# Altium project 3 Channel Buck Converter.PrjPcb
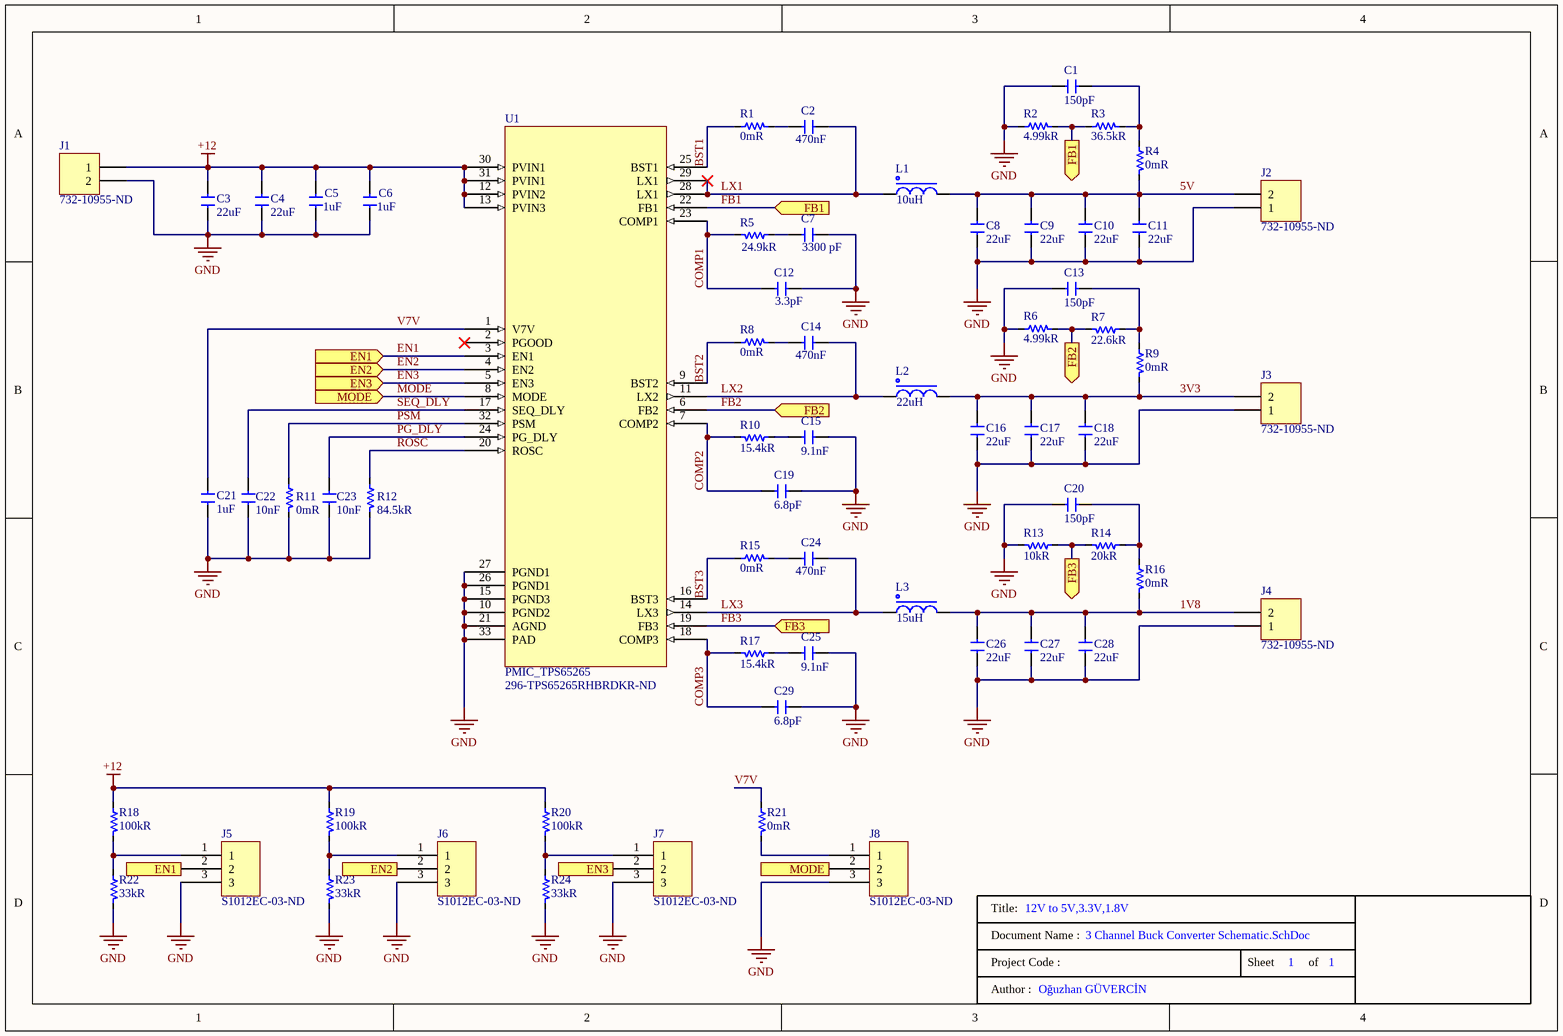
[diagram p0: 3 Channel Buck Converter Schematic.SchDoc]
1 sheet, 65 parts. Net scope: flat (ports and power ports of the same name join across sheets).
Board file: 3 Channel Buck Converter PCB.PcbDoc

## Sheet 3 Channel Buck Converter Schematic.SchDoc: 12V to 5V,3.3V,1.8V
size A4; Author: Oğuzhan GÜVERCİN; SheetNumber: 1; SheetTotal: 1

### Parts
C1  Capacitance: 150pF  [0603_CAP]  (hidden comment: CAP_150pF_%1_0603_50V_NP0_CER)
C2  Capacitance: 470nF  [0603_CAP]  (hidden comment: CAP_0.47uF_%10_0603_25V_X7R_CER)
C3  Capacitance: 22uF  [1206_CAP]  (hidden comment: CAP_22uF_%10_1206_25V_X5R_CER)
C4  Capacitance: 22uF  [1206_CAP]  (hidden comment: CAP_22uF_%10_1206_25V_X5R_CER)
C5  Capacitance: 1uF  [0603_CAP]  (hidden comment: CAP_1uF_%10_0603_25V_X7R_CER)
C6  Capacitance: 1uF  [0603_CAP]  (hidden comment: CAP_1uF_%10_0603_25V_X7R_CER)
C7  Capacitance: 3300 pF  [0603_CAP]  (hidden comment: CAP_3300pF_0603_50V_X7R_CER)
C8  Capacitance: 22uF  [1206_CAP]  (hidden comment: CAP_22uF_%10_1206_25V_X5R_CER)
C9  Capacitance: 22uF  [1206_CAP]  (hidden comment: CAP_22uF_%10_1206_25V_X5R_CER)
C10  Capacitance: 22uF  [1206_CAP]  (hidden comment: CAP_22uF_%10_1206_25V_X5R_CER)
C11  Capacitance: 22uF  [1206_CAP]  (hidden comment: CAP_22uF_%10_1206_25V_X5R_CER)
C12  Capacitance: 3.3pF  [0603_CAP]  (hidden comment: CAP_3.3pF_±0.1pF_0603_50V_NP0_CER)
C13  Capacitance: 150pF  [0603_CAP]  (hidden comment: CAP_150pF_%1_0603_50V_NP0_CER)
C14  Capacitance: 470nF  [0603_CAP]  (hidden comment: CAP_0.47uF_%10_0603_25V_X7R_CER)
C15  Capacitance: 9.1nF  [0603_CAP]  (hidden comment: CAP_9100pF_%5_0603_50V_U2J_CER)
C16  Capacitance: 22uF  [1206_CAP]  (hidden comment: CAP_22uF_%10_1206_25V_X5R_CER)
C17  Capacitance: 22uF  [1206_CAP]  (hidden comment: CAP_22uF_%10_1206_25V_X5R_CER)
C18  Capacitance: 22uF  [1206_CAP]  (hidden comment: CAP_22uF_%10_1206_25V_X5R_CER)
C19  Capacitance: 6.8pF  [0603_CAP]  (hidden comment: CAP_6.8pF_±0.5p_0603_50V_C0G/NP0_CER)
C20  Capacitance: 150pF  [0603_CAP]  (hidden comment: CAP_150pF_%1_0603_50V_NP0_CER)
C21  Capacitance: 1uF  [0603_CAP]  (hidden comment: CAP_1uF_%10_0603_25V_X7R_CER)
C22  Capacitance: 10nF  [0603_CAP]  (hidden comment: CAP_10nF_%20_0603_50V_X7R_CER)
C23  Capacitance: 10nF  [0603_CAP]  (hidden comment: CAP_10nF_%20_0603_50V_X7R_CER)
C24  Capacitance: 470nF  [0603_CAP]  (hidden comment: CAP_0.47uF_%10_0603_25V_X7R_CER)
C25  Capacitance: 9.1nF  [0603_CAP]  (hidden comment: CAP_9100pF_%5_0603_50V_U2J_CER)
C26  Capacitance: 22uF  [1206_CAP]  (hidden comment: CAP_22uF_%10_1206_25V_X5R_CER)
C27  Capacitance: 22uF  [1206_CAP]  (hidden comment: CAP_22uF_%10_1206_25V_X5R_CER)
C28  Capacitance: 22uF  [1206_CAP]  (hidden comment: CAP_22uF_%10_1206_25V_X5R_CER)
C29  Capacitance: 6.8pF  [0603_CAP]  (hidden comment: CAP_6.8pF_±0.5p_0603_50V_C0G/NP0_CER)
J1  Supplier Part Number 1: 732-10955-ND  [1x2_TERMINAL BLOCK]  (hidden comment: CON_1X2_Terminal Block)
J2  Supplier Part Number 1: 732-10955-ND  [1x2_TERMINAL BLOCK]  (hidden comment: CON_1X2_Terminal Block)
J3  Supplier Part Number 1: 732-10955-ND  [1x2_TERMINAL BLOCK]  (hidden comment: CON_1X2_Terminal Block)
J4  Supplier Part Number 1: 732-10955-ND  [1x2_TERMINAL BLOCK]  (hidden comment: CON_1X2_Terminal Block)
J5  Supplier Part Number 1: S1012EC-03-ND  [DIP_1X3_HEADER_2.54_PITCH]  (hidden comment: CON_1X3_2.54mm_Male Header)
J6  Supplier Part Number 1: S1012EC-03-ND  [DIP_1X3_HEADER_2.54_PITCH]  (hidden comment: CON_1X3_2.54mm_Male Header)
J7  Supplier Part Number 1: S1012EC-03-ND  [DIP_1X3_HEADER_2.54_PITCH]  (hidden comment: CON_1X3_2.54mm_Male Header)
J8  Supplier Part Number 1: S1012EC-03-ND  [DIP_1X3_HEADER_2.54_PITCH]  (hidden comment: CON_1X3_2.54mm_Male Header)
L1  Inductance: 10uH  [INDP120120X100N]  (hidden comment: IND_10uH_5A_26.5 mOHM_SMD)
L2  Inductance: 22uH  [INDP120120X100N]  (hidden comment: IND_22uH_3.2A_40 mOHM_SMD)
L3  Inductance: 15uH  [INDP120120X100N]  (hidden comment: IND_15uH_4.6A_36 mOHM_SMD)
R1  Resistance: 0mR  [0603_RES]  (hidden comment: RES_0 OHM_JUMPER_0603_1/10W)
R2  Resistance: 4.99kR  [0603_RES]  (hidden comment: RES_4.99K OHM_1%_0603_1/10W)
R3  Resistance: 36.5kR  [0603_RES]  (hidden comment: RES_36.5K OHM_1%_0603_1/10W)
R4  Resistance: 0mR  [0603_RES]  (hidden comment: RES_0 OHM_JUMPER_0603_1/10W)
R5  Resistance: 24.9kR  [0603_RES]  (hidden comment: RES_24.9K OHM_1%_0603_1/10W)
R6  Resistance: 4.99kR  [0603_RES]  (hidden comment: RES_4.99K OHM_1%_0603_1/10W)
R7  Resistance: 22.6kR  [0603_RES]  (hidden comment: RES_22.6K OHM_1%_0603_1/10W)
R8  Resistance: 0mR  [0603_RES]  (hidden comment: RES_0 OHM_JUMPER_0603_1/10W)
R9  Resistance: 0mR  [0603_RES]  (hidden comment: RES_0 OHM_JUMPER_0603_1/10W)
R10  Resistance: 15.4kR  [0603_RES]  (hidden comment: RES_15.4K OHM_1%_0603_1/10W)
R11  Resistance: 0mR  [0603_RES]  (hidden comment: RES_0 OHM_JUMPER_0603_1/10W)
R12  Resistance: 84.5kR  [0603_RES]  (hidden comment: RES_84.5K OHM_1%_0603_1/10W)
R13  Resistance: 10kR  [0603_RES]  (hidden comment: RES_10K OHM_1%_0603_1/10W)
R14  Resistance: 20kR  [0603_RES]  (hidden comment: RES_20K OHM _1%_0603_1/10W)
R15  Resistance: 0mR  [0603_RES]  (hidden comment: RES_0 OHM_JUMPER_0603_1/10W)
R16  Resistance: 0mR  [0603_RES]  (hidden comment: RES_0 OHM_JUMPER_0603_1/10W)
R17  Resistance: 15.4kR  [0603_RES]  (hidden comment: RES_15.4K OHM_1%_0603_1/10W)
R18  Resistance: 100kR  [0603_RES]  (hidden comment: RES_100K OHM_5%_0603_1/10W)
R19  Resistance: 100kR  [0603_RES]  (hidden comment: RES_100K OHM_5%_0603_1/10W)
R20  Resistance: 100kR  [0603_RES]  (hidden comment: RES_100K OHM_5%_0603_1/10W)
R21  Resistance: 0mR  [0603_RES]  (hidden comment: RES_0 OHM_JUMPER_0603_1/10W)
R22  Resistance: 33kR  [0603_RES]  (hidden comment: RES_33K OHM_5%_0603_1/10W)
R23  Resistance: 33kR  [0603_RES]  (hidden comment: RES_33K OHM_5%_0603_1/10W)
R24  Resistance: 33kR  [0603_RES]  (hidden comment: RES_33K OHM_5%_0603_1/10W)
U1  PMIC_TPS65265  Supplier Part Number 1: 296-TPS65265RHBRDKR-ND  [QFN50P500X500X100_HS-33N]

### Ports
EN1 (in), EN1 (out), EN2 (in), EN2 (out), EN3 (in), EN3 (out), FB1 (in), FB1 (out), FB2 (in), FB2 (out), FB3 (in), FB3 (out), MODE (in), MODE (out)

### Nets
+12: C3.2 C4.2 C5.2 C6.2 J1.1 R18.2 R19.2 R20.2 U1.12(PVIN2) U1.13(PVIN3) U1.30(PVIN1) U1.31(PVIN1)
GND: C1.1 C3.1 C4.1 C5.1 C6.1 C7.2 C8.1 C9.1 C10.1 C11.1 C12.2 C13.1 C15.2 C16.1 C17.1 C18.1 C19.2 C20.1 C21.2 C22.1 C23.1 C25.2 C26.1 C27.1 C28.1 C29.2 J1.2 J2.1 J3.1 J4.1 J5.3 J6.3 J7.3 J8.3 R2.1 R6.1 R11.1 R12.1 R13.1 R22.1 R23.1 R24.1 U1.10(PGND2) U1.15(PGND3) U1.21(AGND) U1.26(PGND1) U1.27(PGND1) U1.33(PAD)
1V8: C26.2 C27.2 C28.2 J4.2 L3.2 R16.2
3V3: C16.2 C17.2 C18.2 J3.2 L2.2 R9.2
5V: C8.2 C9.2 C10.2 C11.2 J2.2 L1.2 R4.2
BST1: R1.2 U1.25(BST1)
BST2: R8.2 U1.9(BST2)
BST3: R15.2 U1.16(BST3)
COMP1: C12.1 R5.1 U1.23(COMP1)
COMP2: C19.1 R10.1 U1.7(COMP2)
COMP3: C29.1 R17.1 U1.18(COMP3)
EN1: J5.2 U1.3(EN1) ; port EN1
EN2: J6.2 U1.4(EN2) ; port EN2
EN3: J7.2 U1.5(EN3) ; port EN3
FB1: R2.2 R3.1 U1.22(FB1) ; port FB1
FB2: R6.2 R7.1 U1.6(FB2) ; port FB2
FB3: R13.2 R14.1 U1.19(FB3) ; port FB3
LX1: C2.2 L1.1 U1.28(LX1) U1.29(LX1)
LX2: C14.2 L2.1 U1.11(LX2)
LX3: C24.2 L3.1 U1.14(LX3)
MODE: J8.2 U1.8(MODE) ; port MODE
PG_DLY: C23.2 U1.24(PG_DLY)
PSM: R11.2 U1.32(PSM)
ROSC: R12.2 U1.20(ROSC)
SEQ_DLY: C22.2 U1.17(SEQ_DLY)
V7V: C21.1 R21.2 U1.1(V7V)
NetC1_2: C1.2 R3.2 R4.1
NetC2_1: C2.1 R1.1
NetC7_1: C7.1 R5.2
NetC13_2: C13.2 R7.2 R9.1
NetC14_1: C14.1 R8.1
NetC15_1: C15.1 R10.2
NetC20_2: C20.2 R14.2 R16.1
NetC24_1: C24.1 R15.1
NetC25_1: C25.1 R17.2
NetJ5_1: J5.1 R18.1 R22.2
NetJ6_1: J6.1 R19.1 R23.2
NetJ7_1: J7.1 R20.1 R24.2
NetJ8_1: J8.1 R21.1

Not connected (* = marked no-connect by the designer): U1 2(PGOOD)*

### Notes on the sheet
- Title:
- Document Name :
- Project Code :
- Sheet
- of
- Author :

### Library data of the parts
C1 C13 C20 = CAP_150pF_%1_0603_50V_NP0_CER: 0603 150 pF 50 V ±1 % Tolerance C0G/NP0 SMT Multilayer Ceramic Capacitor; Manufacturer: Kyocera AVX; Manufacturer Part Number: 06035A151FAT2A; Tolerance: 1%; Dielectric: C0G; Voltage Rating: 50V; Temperature Coefficient: 0ppm/°C; Supplier 1: Digi-Key; RoHS: Yes; Category: Ceramic Capacitors; Stock 1: 18402; Pricing 1: 1=0,22000, 10=0,14900, 50=0,08920, 100=0,07530, 500=0,05154, 1000=0,04559 (USD); Mount: Surface Mount; Case/Package: 0603; Case Code (Metric): 1608; Case Code (Imperial): 0603; Contact Plating: Tin,Matte; Min Operating Temperature: -55°C; Max Operating Temperature: 125°C; Package Quantity: 8000; Packaging: Tape and Reel; Voltage Rating (DC): 50V; Termination: SMD/SMT; Length: 1.6mm; Width: 0.032inch; Depth: 0.81mm; Thickness: 0.035inch; Radiation Hardening: No; REACH SVHC: No SVHC; Lead Free: Lead Free; RoHS Compliant: Yes; ComponentLink1URL: https://datasheet.ciiva.com/11524/ccog-11524364.pdf?src-supplier=Avnet; ComponentLink1Description: https://datasheet.ciiva.com/11524/ccog-11524364.pdf?src-supplier=Avnet; ComponentLink2URL: https://datasheet.ciiva.com/16300/ccog-16300425.pdf?src-supplier=Future+Electronics; ComponentLink2Description: https://datasheet.ciiva.com/16300/ccog-16300425.pdf?src-supplier=Future+Electronics; ComponentLink3URL: https://datasheet.ciiva.com/209/ccog-209668.pdf?src-supplier=Digi-Key; ComponentLink3Description: https://datasheet.ciiva.com/209/ccog-209668.pdf?src-supplier=Digi-Key; ComponentLink4URL: https://datasheet.ciiva.com/22676/1796416-22676952.pdf?src-supplier=Element14; ComponentLink4Description: https://datasheet.ciiva.com/22676/1796416-22676952.pdf?src-supplier=Element14; ComponentLink5URL: https://datasheet.ciiva.com/28533/1796416-28533342.pdf?src-supplier=Element14; ComponentLink5Description: https://datasheet.ciiva.com/28533/1796416-28533342.pdf?src-supplier=Element14; ComponentLink6URL: https://datasheet.ciiva.com/5416/ccog-243403-5416088.pdf?src-supplier=Mouser; ComponentLink6Description: https://datasheet.ciiva.com/5416/ccog-243403-5416088.pdf?src-supplier=Mouser; Supplier Part Number 1: 478-10291-1-ND
C2 C14 C24 = CAP_0.47uF_%10_0603_25V_X7R_CER: 470nF Multilayer Ceramic Capacitor MLCC25 V; X7R Dielectric 0603 Surface Mount; Manufacturer: Wurth Electronics; Manufacturer Part Number: 885012206075; Voltage Rating: 25V; Tolerance: 10%; Supplier 1: Digi-Key; RoHS: Yes; Category: Ceramic Capacitors; Stock 1: 71771; Pricing 1: 1=0,10000, 10=0,09100, 100=0,08200, 500=0,07200 (USD); Mount: Surface Mount; Case/Package: 0603; Case Code (Metric): 1608; Case Code (Imperial): 0603; Min Operating Temperature: -55°C; Max Operating Temperature: 125°C; Packaging: Cut Tape; Dielectric: X7R; Voltage Rating (DC): 25V; Length: 0.063inch; Width: 0.031inch; Thickness: 0.037inch; REACH SVHC: Unknown; RoHS Compliant: Yes; ComponentLink1URL: http://www.farnell.com/datasheets/1958476.pdf?src-supplier=Farnell; ComponentLink1Description: http://www.farnell.com/datasheets/1958476.pdf?src-supplier=Farnell; ComponentLink2URL: https://katalog.we-online.de/pbs/datasheet/885012206075.pdf?src-supplier=Digi-Key; ComponentLink2Description: https://katalog.we-online.de/pbs/datasheet/885012206075.pdf?src-supplier=Digi-Key; ComponentLink3URL: http://www.farnell.com/datasheets/1958476.pdf?src-supplier=Newark; ComponentLink3Description: http://www.farnell.com/datasheets/1958476.pdf?src-supplier=Newark; ComponentLink4URL: http://www.farnell.com/datasheets/1958476.pdf?src-supplier=Element14; ComponentLink4Description: http://www.farnell.com/datasheets/1958476.pdf?src-supplier=Element14; Supplier Part Number 1: 732-7993-1-ND
C3 C4 C8-C11 C16-C18 C26-C28 = CAP_22uF_%10_1206_25V_X5R_CER: 1206 22 uF 25 V ±10% Tolerance X5R Multilayer Ceramic Chip Capacitor; Manufacturer: Yageo; Manufacturer Part Number: CC1206KKX5R8BB226; Voltage Rating: 25V; Supplier 1: Digi-Key; RoHS: Yes; Category: Ceramic Capacitors; Stock 1: 447; Pricing 1: 1=0,70000, 10=0,49700, 50=0,37600, 100=0,32740, 500=0,24256, 1000=0,20617 (USD); Mount: Surface Mount; Case/Package: 1206; Case Code (Imperial): 1206; Case Code (Metric): 3216; Weight: 0.000571oz; Min Operating Temperature: -55°C; Max Operating Temperature: 85°C; Dielectric: X5R; Packaging: Tape and Reel; Tolerance: 10%; Termination: SMD/SMT; Resistor Type: Ceramic; Voltage Rating (DC): 25V; Package Quantity: 2000; Length: 0.126inch; Width: 0.063inch; Thickness: 0.057inch; Lead Free: Lead Free; Halogen Free: Halogen Free; RoHS Compliant: Yes; ComponentLink1URL: http://www.mouser.com/ds/2/447/Yageo_UPY-GP_NP0_16V-to-50V_9-358835.pdf?src-supplier=Mouser; ComponentLink1Description: http://www.mouser.com/ds/2/447/Yageo_UPY-GP_NP0_16V-to-50V_9-358835.pdf?src-supplier=Mouser; ComponentLink2URL: http://www.yageo.com/documents/recent/UPY-GPHC_X5R_4V-to-50V_25.pdf?src-supplier=Digi-Key; ComponentLink2Description: http://www.yageo.com/documents/recent/UPY-GPHC_X5R_4V-to-50V_25.pdf?src-supplier=Digi-Key; ComponentLink3URL: http://www.yageo.com/documents/recent/UPY-GPHC_X5R_4V-to-50V_23.pdf?src-supplier=Digi-Key; ComponentLink3Description: http://www.yageo.com/documents/recent/UPY-GPHC_X5R_4V-to-50V_23.pdf?src-supplier=Digi-Key; Supplier Part Number 1: 311-3448-1-ND
C5 C6 C21 = CAP_1uF_%10_0603_25V_X7R_CER: TAPE DUCT CLOTH GRAY 3/4X 50YDS; Manufacturer: Yageo; Manufacturer Part Number: CC0603KPX7R8BB105; Supplier 1: Digi-Key; RoHS: Yes; Category: Ceramic Capacitors; Stock 1: 56889; Pricing 1: 1=0,26000, 10=0,17700, 50=0,11780, 100=0,10020, 500=0,07070, 1000=0,06186, 2500=0,05892, 5000=0,05450 (USD); Supplier Part Number 1: 13-CC0603KPX7R8BB105CT-ND; Supplier 2: Digi-Key; Stock 2: 56889; Pricing 2: 1=0,26000, 10=0,17700, 50=0,11780, 100=0,10020, 500=0,07070, 1000=0,06186, 2500=0,05892, 5000=0,05450 (USD); Supplier Part Number 2: 13-CC0603KPX7R8BB105DKR-ND
C7 = CAP_3300pF_0603_50V_X7R_CER: 3300 pF ±10% 50V Ceramic Capacitor X7R 0603 (1608 Metric); Manufacturer: Meritek; Manufacturer Part Number: MA0603XR332K500; Case/Package: 0603; Dielectric: X7R; Tolerance: ±10%; Termination: SMD/SMT; Resistor Type: Ceramic; Voltage Rating: 50V
C12 = CAP_3.3pF_±0.1pF_0603_50V_NP0_CER: 0603 3.3 pF 50 V ±0.1 pF Tolerance C0G/NP0 SMT Multilayer Ceramic Capacitor; Manufacturer: Kyocera AVX; Manufacturer Part Number: 06035A3R3BAT2A; Dielectric: C0G; Voltage Rating (DC): 50V; Dissipation Factor: 10%; Supplier 1: Digi-Key; RoHS: Yes; Category: Ceramic Capacitors; Mount: Surface Mount; Case/Package: 0603; Case Code (Imperial): 0603; Case Code (Metric): 1608; Min Operating Temperature: -55°C; Max Operating Temperature: 125°C; Packaging: Tape and Reel; Package Quantity: 1; Voltage Rating: 50V; Termination: SMD/SMT; Series: -; Construction: Flat; Length: 1.6mm; Width: 0.81mm; Height: 0.86mm; Depth: 0.81mm; Thickness: 0.035inch; Radiation Hardening: No; Lead Free: Lead Free; RoHS Compliant: Yes; ComponentLink1URL: https://datasheet.ciiva.com/7614/ccog-7614679.pdf?src-supplier=Digi-Key; ComponentLink1Description: https://datasheet.ciiva.com/7614/ccog-7614679.pdf?src-supplier=Digi-Key; ComponentLink2URL: https://datasheet.ciiva.com/14891/ccog-14891031.pdf?src-supplier=Digi-Key; ComponentLink2Description: https://datasheet.ciiva.com/14891/ccog-14891031.pdf?src-supplier=Digi-Key; ComponentLink3URL: https://datasheet.ciiva.com/14891/ccog-14891032.pdf?src-supplier=Digi-Key; ComponentLink3Description: https://datasheet.ciiva.com/14891/ccog-14891032.pdf?src-supplier=Digi-Key; ComponentLink4URL: https://datasheet.ciiva.com/17493/ccog-17493705.pdf?src-supplier=Avnet+Europe; ComponentLink4Description: https://datasheet.ciiva.com/17493/ccog-17493705.pdf?src-supplier=Avnet+Europe; ComponentLink5URL: https://datasheet.ciiva.com/214/ccog-214122.pdf?src-supplier=Digi-Key; ComponentLink5Description: https://datasheet.ciiva.com/214/ccog-214122.pdf?src-supplier=Digi-Key; ComponentLink6URL: https://datasheet.ciiva.com/11552/ccog-11552874.pdf?src-supplier=Avnet; ComponentLink6Description: https://datasheet.ciiva.com/11552/ccog-11552874.pdf?src-supplier=Avnet; Supplier Part Number 1: 478-7919-1-ND
C15 C25 = CAP_9100pF_%5_0603_50V_U2J_CER: Cap Ceramic 0.0091uF 50V U2J 5% Pad SMD 0603 Flexible Termination 125C T/R; Manufacturer: KEMET; Manufacturer Part Number: C0603X912J5JACTU; Supplier 1: Digi-Key; RoHS: Yes; Category: Ceramic Capacitors; Stock 1: 12624; Pricing 1: 1=0,47000, 10=0,33500, 50=0,25300, 100=0,22040, 500=0,16324, 1000=0,13875 (USD); Mount: Surface Mount; Case/Package: 0603; Case Code (Metric): 1608; Case Code (Imperial): 0603; Min Operating Temperature: -55°C; Max Operating Temperature: 125°C; Packaging: Tape and Reel; Voltage Rating: 50V; Tolerance: 5%; Features: Soft Termination; Length: 0.063inch; Width: 0.031inch; Thickness: 0.034inch; RoHS Compliant: Yes; ComponentLink1URL: http://www.farnell.com/datasheets/2157976.pdf?src-supplier=Element14; ComponentLink1Description: http://www.farnell.com/datasheets/2157976.pdf?src-supplier=Element14; ComponentLink2URL: http://www.kemet.com/docfinder?Partnumber=C0603X912J5JAC7867&src-supplier=Digi-Key; ComponentLink2Description: http://www.kemet.com/docfinder?Partnumber=C0603X912J5JAC7867&src-supplier=Digi-Key; ComponentLink3URL: https://api.kemet.com/component-edge/download/datasheet/C0603X912J5JAC7867.pdf?src-supplier=Digi-Key; ComponentLink3Description: https://api.kemet.com/component-edge/download/datasheet/C0603X912J5JAC7867.pdf?src-supplier=Digi-Key; Supplier Part Number 1: 399-13417-1-ND
C19 C29 = CAP_6.8pF_±0.5p_0603_50V_C0G/NP0_CER: 0603 6.8 pF 50 V ±0.5 pF Tolerance C0G/NP0 SMT Multilayer Ceramic Capacitor; Manufacturer: Kyocera AVX; Manufacturer Part Number: 06035A6R8DAT2A; Dielectric: C0G; Voltage Rating: 50V; Supplier 1: Digi-Key; RoHS: Yes; Category: Ceramic Capacitors; Stock 1: 84698; Pricing 1: 1=0,10000, 10=0,05600, 50=0,03040, 100=0,02480, 500=0,01772, 1000=0,01392 (USD); Mount: Surface Mount; Case/Package: 0603; Case Code (Imperial): 0603; Case Code (Metric): 1608; Min Operating Temperature: -55°C; Max Operating Temperature: 125°C; Packaging: Tape and Reel; Package Quantity: 4000; Voltage Rating (DC): 50V; Termination: SMD/SMT; Length: 1.6mm; Width: 0.81mm; Depth: 0.81mm; Thickness: 0.035inch; Radiation Hardening: No; Lead Free: Lead Free; RoHS Compliant: Yes; ComponentLink1URL: https://datasheet.ciiva.com/16327/ccog-16327085.pdf?src-supplier=Future+Electronics; ComponentLink1Description: https://datasheet.ciiva.com/16327/ccog-16327085.pdf?src-supplier=Future+Electronics; ComponentLink2URL: https://datasheet.ciiva.com/204/ccog-204489.pdf?src-supplier=Digi-Key; ComponentLink2Description: https://datasheet.ciiva.com/204/ccog-204489.pdf?src-supplier=Digi-Key; Supplier Part Number 1: 478-10335-1-ND
C22 C23 = CAP_10nF_%20_0603_50V_X7R_CER: Cap Ceramic 0.01uF 50V X7R 20% SMD 0603 125°C Paper T/R; Manufacturer: KEMET; Manufacturer Part Number: C0603C103M5RAC7411; Supplier 1: Digi-Key; RoHS: Yes; Category: Ceramic Capacitors; Stock 1: 173355; Pricing 1: 1=0,10000, 10=0,03000, 50=0,01640, 100=0,01350, 500=0,00962, 1000=0,00756, 2500=0,00688, 5000=0,00632 (USD); Mount: Surface Mount; Case/Package: 0603; Case Code (Imperial): 0603; Case Code (Metric): 1608; Contact Plating: Tin,Matte; Dielectric Material: Ceramic; Min Operating Temperature: -55°C; Max Operating Temperature: 125°C; Packaging: Tape and Reel; Package Quantity: 50000; Tolerance: 20%; Voltage Rating: 50V; Voltage Rating (DC): 50V; Dielectric: X7R; Termination: SMD/SMT; Series: C0603C; Construction: Flat; Length: 1.6mm; Height: 0.8mm; Lead Pitch: 0.7mm; Depth: 0.8mm; Radiation Hardening: No; RoHS Compliant: Yes; ComponentLink1URL: http://www.mouser.com/ds/2/212/KEM_C1002_X7R_SMD-1102033.pdf?src-supplier=Mouser; ComponentLink1Description: http://www.mouser.com/ds/2/212/KEM_C1002_X7R_SMD-1102033.pdf?src-supplier=Mouser; ComponentLink2URL: http://capacitoredge.kemet.com/capedge2/DataSheet?pn=C0603C103M5RAC7411&src-supplier=Avnet; ComponentLink2Description: http://capacitoredge.kemet.com/capedge2/DataSheet?pn=C0603C103M5RAC7411&src-supplier=Avnet; Supplier Part Number 1: 399-C0603C103M5RAC7411CT-ND
J1-J4 = CON_1X2_Terminal Block: Series 1377 - 5.00 mm Horizontal Entry with Pressure Clamp WR-TBL, 2 pin; Manufacturer: Wurth Electronics; Manufacturer Part Number: 691137710002; Plating: Copper Alloy; Number of Levels: 1; Number of Positions Per Level: 2; Current: 16A; Voltage: 300V; Wire Gauge (Max): 30AWG; Wire Gauge (Min): 12AWG; Supplier 1: Digi-Key; RoHS: No; Category: Terminal Blocks; Stock 1: 10587; Pricing 1: 1=0,39000, 10=0,35200, 50=0,31100, 100=0,27900, 500=0,26900 (USD); Mount: Through Hole; Color: Green; Housing Material: PC; Min Operating Temperature: -30°C; Max Operating Temperature: 120°C; Packaging: Bulk; Termination: Screw; ComponentLink1URL: https://katalog.we-online.de/em/datasheet/691137710002.pdf?src-supplier=Digi-Key; ComponentLink1Description: https://katalog.we-online.de/em/datasheet/691137710002.pdf?src-supplier=Digi-Key
J5-J8 = CON_1X3_2.54mm_Male Header: Conn Header Vert 3POS 2.54MM; Manufacturer: Sullins; Manufacturer Part Number: PREC003SAAN-RC; Number of Positions: 3; Connector Type: Male Pin; Pitch: 0.1inch; Supplier 1: Digi-Key; RoHS: Yes; Category: Connectors; Stock 1: 15048; Pricing 1: 1=0,09000, 10=0,08400, 25=0,06240, 50=0,05340, 100=0,05170, 250=0,04456, 500=0,04276 (USD); Mount: Through Hole; Color: Black; Contact Plating: Tin; Package Quantity: 1; Number of Rows: 1; Packaging: Bulk; Termination: Solder; Series: -; Contact Type: Male Pin; Contact Mating Length: 0.23inch; RoHS Compliant: Yes; ComponentLink1URL: https://datasheet.ciiva.com/740/zrzczzzszzn-rc-st-11635-b-740842.pdf?src-supplier=Digi-Key; ComponentLink1Description: https://datasheet.ciiva.com/740/zrzczzzszzn-rc-st-11635-b-740842.pdf?src-supplier=Digi-Key
L1 = IND_10uH_5A_26.5 mOHM_SMD: Fixed Ind 10UH 5A 26.5 Mohm SMD; Manufacturer: Wurth Electronics; Manufacturer Part Number: 784771100; Core Material: Ferrite; Saturation Current: 5.25A; Shielding: Shielded; DC Resistance (DCR): 26.5mR; Self Resonant Frequency: 22.3MHz; Test Frequency: 100kHz; Tolerance: 20%; Supplier 1: Mouser; RoHS: Yes; Category: Fixed Inductors; Stock 1: 177; Pricing 1: 1=2,37000, 10=2,11000, 50=1,96000, 100=1,89000, 1000=1,65000, 10000=1,65000 (USD); Mount: Surface Mount; Case/Package: Nonstandard; Min Operating Temperature: -40°C; Max Operating Temperature: 125°C; Packaging: Tape and Reel; Resistor Type: Wirewound; Current Rating: 5A; Length: 0.472inch; Width: 0.472inch; Height - Seated (Max): 0.248inch; Ratings: AEC-Q200; RoHS Compliant: No; ComponentLink1URL: https://media.digikey.com/pdf/Data%20Sheets/Wurth%20Electronics%20PDFs/Q+_Products_Flyer.pdf?src-supplier=Digi-Key; ComponentLink1Description: https://media.digikey.com/pdf/Data%20Sheets/Wurth%20Electronics%20PDFs/Q+_Products_Flyer.pdf?src-supplier=Digi-Key; Supplier Part Number 1: 710-784771100
L2 = IND_22uH_3.2A_40 mOHM_SMD: Fixed Ind 22UH 3.2A 40 Mohm SMD; Manufacturer: Wurth Electronics; Manufacturer Part Number: 784771220; Core Material: Ferrite; Saturation Current: 3.5A; Shielding: Shielded; DC Resistance (DCR): 40mR; Self Resonant Frequency: 14.9MHz; Test Frequency: 100kHz; Tolerance: 20%; Supplier 1: Digi-Key; RoHS: Yes; Category: Fixed Inductors; Stock 1: 156; Pricing 1: 1=2,37000, 10=2,10900, 50=1,95900, 100=1,88400, 250=1,80800 (USD); Mount: Surface Mount; Case/Package: Nonstandard; Min Operating Temperature: -40°C; Max Operating Temperature: 125°C; Packaging: Cut Tape; Resistor Type: Wirewound; Current Rating: 3.2A; Length: 0.472inch; Width: 0.472inch; Height - Seated (Max): 0.248inch; Ratings: AEC-Q200; RoHS Compliant: No; ComponentLink1URL: https://media.digikey.com/pdf/Data%20Sheets/Wurth%20Electronics%20PDFs/Q+_Products_Flyer.pdf?src-supplier=Digi-Key; ComponentLink1Description: https://media.digikey.com/pdf/Data%20Sheets/Wurth%20Electronics%20PDFs/Q+_Products_Flyer.pdf?src-supplier=Digi-Key; Supplier Part Number 1: 732-6773-1-ND
L3 = IND_15uH_4.6A_36 mOHM_SMD: Inductor, Aec-Q200, 15Uh, Shld, 4.6A Rohs Compliant: Yes; Manufacturer: Wurth Electronics; Manufacturer Part Number: 7847709150; Supplier 1: Digi-Key; RoHS: No; Category: Fixed Inductors; Stock 1: 908; Pricing 1: 1=2,82000, 10=2,78200, 50=2,59700, 100=2,41200 (USD); RoHS Compliant: No; Supplier Part Number 1: 732-11747-1-ND
R1 R4 R8 R9 R11 R15 R16 R21 = RES_0 OHM_JUMPER_0603_1/10W: CRCW Thick Film Commodity Chip Resistor Jumper 0603 Size 0 Ohm 0.1 W 2-Pin SMD Paper T/R; Manufacturer: Vishay; Manufacturer Part Number: CRCW06030000Z0EBC; Max Power Dissipation: 100mW; Supplier 1: Digi-Key; RoHS: Yes; Category: Chip SMD Resistors; Stock 1: 708702; Pricing 1: 10000=0,00332 (USD); Case/Package: 0603; Case Code (Imperial): 0603; Case Code (Metric): 1608; Min Operating Temperature: -55°C; Max Operating Temperature: 155°C; Resistor Type: Thick Film; Packaging: Cut Tape; Number of Terminations: 2; RoHS Compliant: Yes; ComponentLink1URL: http://www.vishay.com/docs/28773/crcwce3.pdf?src-supplier=Digi-Key; ComponentLink1Description: http://www.vishay.com/docs/28773/crcwce3.pdf?src-supplier=Digi-Key; Supplier Part Number 1: 541-4013-2-ND
R2 R6 = RES_4.99K OHM_1%_0603_1/10W: Res Thick Film 0603 4.99K Ohm 1% 1/10W ±100ppm/°C Molded SMD SMD Paper T/R; Manufacturer: Vishay Dale; Manufacturer Part Number: CRCW06034K99FKEB; Power Rating: 100mW; Voltage Rating: 75V; Supplier 1: Digi-Key; RoHS: Yes; Category: Chip SMD Resistors; Pricing 1: 1=0,10000, 10=0,03800, 100=0,01560, 1000=0,00701, 2500=0,00608, 5000=0,00503 (USD); Mount: Surface Mount; Case/Package: 0603; Weight: 7.1E-05oz; Case Code (Imperial): 0603; Case Code (Metric): 1608; Contact Plating: Tin; Size Code: 0603; Min Operating Temperature: -55°C; Max Operating Temperature: 155°C; Tolerance: 1%; Packaging: Tape and Reel; Package Quantity: 10000; Resistor Type: Thick Film; Number of Terminations: 2; Temperature Coefficient: 100ppm/°C; Max Power Dissipation: 100mW; Voltage Rating (DC): 75V; Features: Automotive AEC-Q200; Series: CRCW; Resistance Tolerance: 1%; Construction: Rectangular; Length: 1.55mm; Width: 0.85mm; Height: 0.02inch; Depth: 0.85mm; RoHS Compliant: Yes; REACH SVHC: Unknown; Military Standard: Not; Lead Free: Lead Free; ComponentLink1URL: https://datasheet.ciiva.com/5548/dcrcwe3-109170-5548185.pdf?src-supplier=Mouser; ComponentLink1Description: https://datasheet.ciiva.com/5548/dcrcwe3-109170-5548185.pdf?src-supplier=Mouser; ComponentLink2URL: https://datasheet.ciiva.com/9069/dcrcwe3-9069243.pdf?src-supplier=Avnet; ComponentLink2Description: https://datasheet.ciiva.com/9069/dcrcwe3-9069243.pdf?src-supplier=Avnet; Supplier Part Number 1: 541-CRCW06034K99FKEBCT-ND
R3 = RES_36.5K OHM_1%_0603_1/10W: Res Thick Film 0603 36.5K Ohm 1% 0.1W(1/10W) ±100ppm/C Molded SMD Automotive Paper T/R; Manufacturer: Vishay; Manufacturer Part Number: CRCW060336K5FKEA; Power Rating: 100mW; Voltage Rating: 75V; Temperature Coefficient: 100ppm/°C; RoHS: Yes; Category: Chip SMD Resistors; Pricing 1: 1=0,10000, 10=0,03800, 100=0,01560, 1000=0,00701, 2500=0,00608 (USD); Case/Package: 0603; Number of Pins: 2; Weight: 7.1E-05oz; Case Code (Imperial): 0603; Case Code (Metric): 1608; Contact Plating: Tin; Size Code: 0603; Min Operating Temperature: -55°C; Max Operating Temperature: 155°C; Tolerance: 1%; Packaging: Tape and Reel; Package Quantity: 5000; Resistor Type: Thick Film; Termination: SMD/SMT; Voltage Rating (DC): 75V; Features: Automotive AEC-Q200; Series: CRCW; Max Power Dissipation: 100mW; Number of Terminations: 2; Resistance Tolerance: 1%; Construction: Rectangular; Technology: THICK FILM; Length: 1.55mm; Width: 0.85mm; Height: 0.45mm; Depth: 0.85mm; Radiation Hardening: No; RoHS Compliant: Yes; REACH SVHC: Unknown; Military Standard: Not; Lead Free: Lead Free; ComponentLink1URL: https://datasheet.ciiva.com/11810/0900766b80d98afc-11810172.pdf?src-supplier=RSComponents; ComponentLink1Description: https://datasheet.ciiva.com/11810/0900766b80d98afc-11810172.pdf?src-supplier=RSComponents; ComponentLink2URL: https://datasheet.ciiva.com/5545/dcrcwe3-109170-5545862.pdf?src-supplier=Mouser; ComponentLink2Description: https://datasheet.ciiva.com/5545/dcrcwe3-109170-5545862.pdf?src-supplier=Mouser; ComponentLink3URL: https://datasheet.ciiva.com/3257/dcrcwe3-3257495.pdf?src-supplier=Avnet; ComponentLink3Description: https://datasheet.ciiva.com/3257/dcrcwe3-3257495.pdf?src-supplier=Avnet; ComponentLink4URL: https://datasheet.ciiva.com/3257/dcrcwe3-3257496.pdf?src-supplier=Avnet; ComponentLink4Description: https://datasheet.ciiva.com/3257/dcrcwe3-3257496.pdf?src-supplier=Avnet; ComponentLink5URL: https://datasheet.ciiva.com/16765/70201119-16765097.pdf?src-supplier=Allied+Electronics; ComponentLink5Description: https://datasheet.ciiva.com/16765/70201119-16765097.pdf?src-supplier=Allied+Electronics; ComponentLink6URL: https://datasheet.ciiva.com/16893/dcrcwe3-16893273.pdf?src-supplier=Avnet+Europe; ComponentLink6Description: https://datasheet.ciiva.com/16893/dcrcwe3-16893273.pdf?src-supplier=Avnet+Europe; ComponentLink7URL: https://datasheet.ciiva.com/22705/1697337-22705850.pdf?src-supplier=Element14; ComponentLink7Description: https://datasheet.ciiva.com/22705/1697337-22705850.pdf?src-supplier=Element14; ComponentLink8URL: https://datasheet.ciiva.com/7671/1697337-7671643.pdf?src-supplier=Element14; ComponentLink8Description: https://datasheet.ciiva.com/7671/1697337-7671643.pdf?src-supplier=Element14; ComponentLink9URL: https://datasheet.ciiva.com/7792/125364-7792235.pdf?src-supplier=Element14; ComponentLink9Description: https://datasheet.ciiva.com/7792/125364-7792235.pdf?src-supplier=Element14; ComponentLink10URL: https://datasheet.ciiva.com/7671/1697337-7671644.pdf?src-supplier=Element14; ComponentLink10Description: https://datasheet.ciiva.com/7671/1697337-7671644.pdf?src-supplier=Element14; ComponentLink11URL: https://datasheet.ciiva.com/16395/dcrcwe3-16395406.pdf?src-supplier=Future+Electronics; ComponentLink11Description: https://datasheet.ciiva.com/16395/dcrcwe3-16395406.pdf?src-supplier=Future+Electronics; Supplier Part Number 1: 541-36.5KHCT-ND; Supplier 1: Digi-Key
R5 = RES_24.9K OHM_1%_0603_1/10W: Res Thick Film 0603 24.9K Ohm 1% 1/10W ±100ppm/°C Molded SMD SMD Paper T/R; Manufacturer: Vishay Dale; Manufacturer Part Number: CRCW060324K9FKTA; Power Rating: 100mW; Voltage Rating: 75V; Supplier 1: Digi-Key; RoHS: No; Category: Chip SMD Resistors; Stock 1: 743; Pricing 1: 1=0,16000, 10=0,13900, 100=0,05350, 1000=0,02353, 2500=0,02032 (USD); Case/Package: 0603; Number of Pins: 2; Weight: 7.1E-05oz; Case Code (Imperial): 0603; Case Code (Metric): 1608; Contact Plating: Tin,Lead; Size Code: 0603; Min Operating Temperature: -55°C; Max Operating Temperature: 155°C; Tolerance: 1%; Resistor Type: Thick Film; Packaging: Tape and Reel; Package Quantity: 5000; Number of Terminations: 2; Temperature Coefficient: 100ppm/°C; Max Power Dissipation: 100mW; Power Dissipation: 100mW; Voltage Rating (DC): 75V; Features: Automotive AEC-Q200; Series: CRCW; Construction: Rectangular; Resistance Tolerance: 1%; Length: 1.55mm; Width: 0.85mm; Height: 0.02inch; Depth: 0.85mm; Radiation Hardening: No; RoHS Compliant: No; REACH SVHC: Unknown; Military Standard: Not; Lead Free: Contains Lead; ComponentLink1URL: https://datasheet.ciiva.com/16430/dcrcw-16430103.pdf?src-supplier=Future+Electronics; ComponentLink1Description: https://datasheet.ciiva.com/16430/dcrcw-16430103.pdf?src-supplier=Future+Electronics; ComponentLink2URL: https://datasheet.ciiva.com/2565/dcrcw-2565163.pdf?src-supplier=Digi-Key; ComponentLink2Description: https://datasheet.ciiva.com/2565/dcrcw-2565163.pdf?src-supplier=Digi-Key; ComponentLink3URL: https://datasheet.ciiva.com/9024/dcrcw-9024956.pdf?src-supplier=Avnet; ComponentLink3Description: https://datasheet.ciiva.com/9024/dcrcw-9024956.pdf?src-supplier=Avnet; Supplier Part Number 1: 541-CRCW060324K9FKTACT-ND
R7 = RES_22.6K OHM_1%_0603_1/10W: CRCW Thick Film Commodity Chip Resistor 0603 Size 22.6K Ohm 1% 0.1 W 100 ppm/K 2-Pin SMD Paper T/R; Manufacturer: Vishay; Manufacturer Part Number: CRCW060322K6FKEBC; Supplier 1: Digi-Key; RoHS: Yes; Category: Chip SMD Resistors; Pricing 1: 60000=0,00313, 100000=0,00307 (USD); RoHS Compliant: Yes; Supplier Part Number 1: CRCW060322K6FKEBC-ND
R10 R17 = RES_15.4K OHM_1%_0603_1/10W: Res SMD 15.4K Ohm 1% 1/10W 0603; Manufacturer: Vishay Dale; Manufacturer Part Number: CRCW060315K4FKEB; Power Rating: 100mW; Voltage Rating: 75V; Temperature Coefficient: 100ppm/°C; Supplier 1: Digi-Key; RoHS: Yes; Category: Chip SMD Resistors; Stock 1: 6; Pricing 1: 1=0,10000, 10=0,03800, 100=0,01560, 1000=0,00701, 2500=0,00608, 5000=0,00503 (USD); Case/Package: 0603; Weight: 7.1E-05oz; Case Code (Imperial): 0603; Case Code (Metric): 1608; Min Operating Temperature: -55°C; Max Operating Temperature: 155°C; Tolerance: 1%; Packaging: Tape and Reel; Package Quantity: 10000; Resistor Type: Thick Film; Number of Terminations: 2; Termination: SMD/SMT; Max Power Dissipation: 100mW; Features: Automotive AEC-Q200; Series: CRCW; Length: 0.061inch; Width: 0.033inch; Height: 0.02inch; RoHS Compliant: Yes; Lead Free: Lead Free; ComponentLink1URL: https://datasheet.ciiva.com/5544/dcrcwe3-109170-5544853.pdf?src-supplier=Mouser; ComponentLink1Description: https://datasheet.ciiva.com/5544/dcrcwe3-109170-5544853.pdf?src-supplier=Mouser; Supplier Part Number 1: 541-CRCW060315K4FKEBCT-ND
R12 = RES_84.5K OHM_1%_0603_1/10W: Res Thick Film 0603 84.5K Ohm 1% 1/10W ±100ppm/°C Molded SMD SMD Paper T/R; Manufacturer: Vishay; Manufacturer Part Number: CRCW060384K5FKEA; Power Rating: 100mW; Voltage Rating: 75V; Supplier 1: Digi-Key; RoHS: Yes; Category: Chip SMD Resistors; Stock 1: 4; Pricing 1: 1=0,10000, 10=0,03800, 100=0,01560, 1000=0,00701, 2500=0,00608 (USD); Case/Package: 0603; Number of Pins: 2; Weight: 7.1E-05oz; Case Code (Imperial): 0603; Case Code (Metric): 1608; Contact Plating: Tin; Min Operating Temperature: -55°C; Max Operating Temperature: 155°C; Tolerance: 1%; Packaging: Tape and Reel; Package Quantity: 10; Termination: SMD/SMT; Resistor Type: Thick Film; Number of Terminations: 2; Temperature Coefficient: 100ppm/°C; Max Power Dissipation: 100mW; Voltage Rating (DC): 75V; Features: Automotive AEC-Q200; Series: CRCW; Construction: Rectangular; Resistance Tolerance: 1%; Length: 1.55mm; Width: 0.85mm; Height: 0.02inch; Depth: 0.85mm; Radiation Hardening: No; REACH SVHC: Unknown; Military Standard: Not; Lead Free: Lead Free; RoHS Compliant: Yes; ComponentLink1URL: https://datasheet.ciiva.com/8986/dcrcwe3-8986391.pdf?src-supplier=Avnet; ComponentLink1Description: https://datasheet.ciiva.com/8986/dcrcwe3-8986391.pdf?src-supplier=Avnet; ComponentLink2URL: https://datasheet.ciiva.com/22871/70201119-22871818.pdf?src-supplier=Allied+Electronics; ComponentLink2Description: https://datasheet.ciiva.com/22871/70201119-22871818.pdf?src-supplier=Allied+Electronics; ComponentLink3URL: https://datasheet.ciiva.com/2513/dcrcwe3-2513644.pdf?src-supplier=Digi-Key; ComponentLink3Description: https://datasheet.ciiva.com/2513/dcrcwe3-2513644.pdf?src-supplier=Digi-Key; ComponentLink4URL: https://datasheet.ciiva.com/2513/dcrcwe3-2513645.pdf?src-supplier=Digi-Key; ComponentLink4Description: https://datasheet.ciiva.com/2513/dcrcwe3-2513645.pdf?src-supplier=Digi-Key; ComponentLink5URL: https://datasheet.ciiva.com/16204/dcrcw-16204237.pdf?src-supplier=Future+Electronics; ComponentLink5Description: https://datasheet.ciiva.com/16204/dcrcw-16204237.pdf?src-supplier=Future+Electronics; ComponentLink6URL: https://datasheet.ciiva.com/2513/dcrcwe3-2513646.pdf?src-supplier=Digi-Key; ComponentLink6Description: https://datasheet.ciiva.com/2513/dcrcwe3-2513646.pdf?src-supplier=Digi-Key; ComponentLink7URL: https://datasheet.ciiva.com/7816/1697337-7816078.pdf?src-supplier=Element14; ComponentLink7Description: https://datasheet.ciiva.com/7816/1697337-7816078.pdf?src-supplier=Element14; ComponentLink8URL: https://datasheet.ciiva.com/7816/1697337-7816079.pdf?src-supplier=Element14; ComponentLink8Description: https://datasheet.ciiva.com/7816/1697337-7816079.pdf?src-supplier=Element14; Supplier Part Number 1: 541-84.5KHCT-ND
R13 = RES_10K OHM_1%_0603_1/10W: Res Thick Film 0603 10K Ohm 1% 0.1W(1/10W) ±100ppm/C Pad SMD Automotive T/R; Manufacturer: Vishay Dale; Manufacturer Part Number: CRCW060310K0FKEE; Max Power Dissipation: 100mW; Temperature Coefficient: 100ppm/°C; Supplier 1: Digi-Key; RoHS: Yes; Category: Chip SMD Resistors; Pricing 1: 50000=0,00352 (USD); Case/Package: 0603; Min Operating Temperature: -55°C; Max Operating Temperature: 155°C; Package Quantity: 50000; Packaging: Tape and Reel; Resistor Type: Thick Film; Number of Terminations: 2; Tolerance: 1%; Features: Automotive AEC-Q200; Length: 0.061inch; Width: 0.033inch; Height: 0.02inch; Lead Free: Lead Free; RoHS Compliant: Yes; ComponentLink1URL: http://www.vishay.com/docs/20035/dcrcwe3.pdf?src-supplier=Digi-Key; ComponentLink1Description: http://www.vishay.com/docs/20035/dcrcwe3.pdf?src-supplier=Digi-Key; Supplier Part Number 1: CRCW060310K0FKEE-ND
R14 = RES_20K OHM _1%_0603_1/10W: Res Thick Film 0603 20K Ohm 1% 1/10W ±100ppm/°C Molded SMD SMD Paper T/R; Manufacturer: Vishay Dale; Manufacturer Part Number: CRCW060320K0FKEB; Power Rating: 100mW; Voltage Rating: 75V; Supplier 1: Digi-Key; RoHS: Yes; Category: Chip SMD Resistors; Pricing 1: 1=0,10000, 10=0,03800, 100=0,01560, 1000=0,00701, 2500=0,00608, 5000=0,00503 (USD); Case/Package: 0603; Number of Pins: 2; Weight: 7.1E-05oz; Case Code (Imperial): 0603; Case Code (Metric): 1608; Contact Plating: Tin; Min Operating Temperature: -55°C; Max Operating Temperature: 155°C; Tolerance: 1%; Packaging: Tape and Reel; Package Quantity: 10000; Resistor Type: Thick Film; Number of Terminations: 2; Temperature Coefficient: 100ppm/°C; Max Power Dissipation: 100mW; Voltage Rating (DC): 75V; Features: Automotive AEC-Q200; Series: CRCW; Resistance Tolerance: 1%; Construction: Rectangular; Length: 1.55mm; Width: 0.85mm; Height: 0.02inch; Depth: 0.85mm; Radiation Hardening: No; REACH SVHC: Unknown; Military Standard: Not; Lead Free: Lead Free; RoHS Compliant: Yes; ComponentLink1URL: http://components.arrow.com/part/dataview/41401338S39653N6892?src-supplier=Arrow+Electronics; ComponentLink1Description: http://components.arrow.com/part/dataview/41401338S39653N6892?src-supplier=Arrow+Electronics; ComponentLink2URL: http://www.mouser.com/ds/2/427/dcrcwe3-109170.pdf?src-supplier=Mouser; ComponentLink2Description: http://www.mouser.com/ds/2/427/dcrcwe3-109170.pdf?src-supplier=Mouser; ComponentLink3URL: http://www.farnell.com/datasheets/2111203.pdf?src-supplier=Farnell; ComponentLink3Description: http://www.farnell.com/datasheets/2111203.pdf?src-supplier=Farnell; ComponentLink4URL: http://components.arrow.com/part/dataview/0323_06078073?src-supplier=Arrow+Europe; ComponentLink4Description: http://components.arrow.com/part/dataview/0323_06078073?src-supplier=Arrow+Europe; ComponentLink5URL: http://www.farnell.com/datasheets/2111203.pdf?src-supplier=Newark; ComponentLink5Description: http://www.farnell.com/datasheets/2111203.pdf?src-supplier=Newark; ComponentLink6URL: http://www.vishay.com/docs/20035/dcrcwe3.pdf?src-supplier=Avnet; ComponentLink6Description: http://www.vishay.com/docs/20035/dcrcwe3.pdf?src-supplier=Avnet; ComponentLink7URL: http://www.farnell.com/datasheets/2111203.pdf?src-supplier=Element14; ComponentLink7Description: http://www.farnell.com/datasheets/2111203.pdf?src-supplier=Element14; ComponentLink8URL: http://www.vishay.com/docs/20035/dcrcwe3.pdf?src-supplier=Digi-Key; ComponentLink8Description: http://www.vishay.com/docs/20035/dcrcwe3.pdf?src-supplier=Digi-Key; Supplier Part Number 1: 541-CRCW060320K0FKEBDKR-ND
R18-R20 = RES_100K OHM_5%_0603_1/10W: Res Thick Film 0603 100K Ohm 5% 1/10W ±200ppm/°C Molded SMD SMD Paper T/R; Manufacturer: Vishay Dale; Manufacturer Part Number: CRCW0603100KJNEB; Power Rating: 100mW; Voltage Rating: 75V; RoHS: Yes; Category: Chip SMD Resistors; Stock 1: 592; Pricing 1: 1=0,10000, 10=0,03300, 100=0,01360, 1000=0,00610, 2500=0,00529, 5000=0,00437 (USD); Case/Package: 0603; Weight: 7.1E-05oz; Case Code (Imperial): 0603; Case Code (Metric): 1608; Contact Plating: Tin; Min Operating Temperature: -55°C; Max Operating Temperature: 155°C; Packaging: Tape and Reel; Tolerance: 5%; Package Quantity: 10000; Resistor Type: Thick Film; Number of Terminations: 2; Termination: SMD/SMT; Temperature Coefficient: 200ppm/°C; Max Power Dissipation: 100mW; Features: Automotive AEC-Q200; Series: CRCW; Construction: Rectangular; Length: 1.55mm; Width: 0.033inch; Height: 0.02inch; Depth: 0.85mm; Radiation Hardening: No; RoHS Compliant: Yes; Military Standard: Not; Lead Free: Lead Free; ComponentLink1URL: https://datasheet.ciiva.com/5543/dcrcwe3-109170-5543336.pdf?src-supplier=Mouser; ComponentLink1Description: https://datasheet.ciiva.com/5543/dcrcwe3-109170-5543336.pdf?src-supplier=Mouser; ComponentLink2URL: https://datasheet.ciiva.com/3256/dcrcwe3-3256922.pdf?src-supplier=Avnet; ComponentLink2Description: https://datasheet.ciiva.com/3256/dcrcwe3-3256922.pdf?src-supplier=Avnet; ComponentLink3URL: https://datasheet.ciiva.com/3256/dcrcwe3-3256923.pdf?src-supplier=Avnet; ComponentLink3Description: https://datasheet.ciiva.com/3256/dcrcwe3-3256923.pdf?src-supplier=Avnet; Supplier Part Number 1: 541-CRCW0603100KJNEBCT-ND; Supplier 1: Digi-Key
R22-R24 = RES_33K OHM_5%_0603_1/10W: Res Thick Film 0603 33K Ohm 5% 1/10W ±200ppm/°C Molded SMD SMD Paper T/R; Manufacturer: Vishay Dale; Manufacturer Part Number: CRCW060333K0JNEA; Power Rating: 100mW; Voltage Rating: 75V; Supplier 1: Digi-Key; RoHS: Yes; Category: Chip SMD Resistors; Stock 1: 6675; Pricing 1: 1=0,10000, 10=0,03300, 100=0,01360, 1000=0,00610, 2500=0,00529 (USD); Mount: Surface Mount; Case/Package: 0603; Number of Pins: 2; Case Code (Metric): 1608; Case Code (Imperial): 0603; Weight: 7.1E-05oz; Contact Plating: Tin; Size Code: 0603; Min Operating Temperature: -55°C; Max Operating Temperature: 155°C; Tolerance: 5%; Packaging: Tape and Reel; Resistor Type: Thick Film; Package Quantity: 1; Number of Terminations: 2; Termination: SMD/SMT; Temperature Coefficient: 200ppm/°C; Max Power Dissipation: 100mW; Voltage Rating (DC): 75V; Features: Automotive AEC-Q200; Series: CRCW; Construction: Rectangular; Resistance Tolerance: 5%; Technology: THICK FILM; Length: 1.55mm; Width: 0.033inch; Height: 0.45mm; Depth: 0.85mm; Radiation Hardening: No; Lead Free: Lead Free; RoHS Compliant: Yes; Military Standard: Not; REACH SVHC: Unknown; ComponentLink1URL: https://datasheet.ciiva.com/2462/dcrcwe3-2462529.pdf?src-supplier=Digi-Key; ComponentLink1Description: https://datasheet.ciiva.com/2462/dcrcwe3-2462529.pdf?src-supplier=Digi-Key; ComponentLink2URL: https://datasheet.ciiva.com/2462/dcrcwe3-2462530.pdf?src-supplier=Digi-Key; ComponentLink2Description: https://datasheet.ciiva.com/2462/dcrcwe3-2462530.pdf?src-supplier=Digi-Key; ComponentLink3URL: https://datasheet.ciiva.com/2462/dcrcwe3-2462531.pdf?src-supplier=Digi-Key; ComponentLink3Description: https://datasheet.ciiva.com/2462/dcrcwe3-2462531.pdf?src-supplier=Digi-Key; ComponentLink4URL: https://datasheet.ciiva.com/16778/70201119-16778952.pdf?src-supplier=Allied+Electronics; ComponentLink4Description: https://datasheet.ciiva.com/16778/70201119-16778952.pdf?src-supplier=Allied+Electronics; ComponentLink5URL: https://datasheet.ciiva.com/5551/dcrcwe3-109170-5551035.pdf?src-supplier=Mouser; ComponentLink5Description: https://datasheet.ciiva.com/5551/dcrcwe3-109170-5551035.pdf?src-supplier=Mouser; ComponentLink6URL: https://datasheet.ciiva.com/16389/dcrcwe3-16389979.pdf?src-supplier=Future+Electronics; ComponentLink6Description: https://datasheet.ciiva.com/16389/dcrcwe3-16389979.pdf?src-supplier=Future+Electronics; ComponentLink7URL: https://datasheet.ciiva.com/3257/dcrcwe3-3257469.pdf?src-supplier=Avnet; ComponentLink7Description: https://datasheet.ciiva.com/3257/dcrcwe3-3257469.pdf?src-supplier=Avnet; ComponentLink8URL: https://datasheet.ciiva.com/3257/dcrcwe3-3257470.pdf?src-supplier=Avnet; ComponentLink8Description: https://datasheet.ciiva.com/3257/dcrcwe3-3257470.pdf?src-supplier=Avnet; Supplier Part Number 1: 541-33KGCT-ND
U1 = PMIC_TPS65265: 4.5- to 17-V Input Voltage, 5-A/3-A/2-A Output Current Triple Buck Converter 32-VQFN -40 to 85; Manufacturer: Texas Instruments; Manufacturer Part Number: TPS65265RHBR; Output Type: Adjustable; Output Configuration: Positive; Number of Outputs: 3; Min Input Voltage: 4.5V; Max Input Voltage: 17V; Min Output Voltage: 600mV; Output Current: 2A; Switching Frequency: 2.3MHz; Synchronous Rectifier: Yes; Supplier 1: Digi-Key; RoHS: Yes; Category: Voltage Regulators - Switching; Pricing 1: 1=3,40000, 10=3,05300, 25=2,88600, 100=2,50110, 250=2,37280, 500=2,12912, 1000=2,11750 (USD); Mount: Surface Mount; Case/Package: VQFN; Min Operating Temperature: -40°C; Max Operating Temperature: 85°C; Packaging: Tape and Reel; Max Output Voltage: 17V; Lead Free: Lead Free; RoHS Compliant: Yes; ComponentLink1URL: http://www.ti.com/lit/gpn/tps65265?src-supplier=Mouser; ComponentLink1Description: http://www.ti.com/lit/gpn/tps65265?src-supplier=Mouser; ComponentLink2URL: http://www.ti.com/lit/ds/symlink/tps65265.pdf?src-supplier=Digi-Key; ComponentLink2Description: http://www.ti.com/lit/ds/symlink/tps65265.pdf?src-supplier=Digi-Key